# Altium schematic sheet RM04-KITV.SchDoc
size 558 x 431 mm
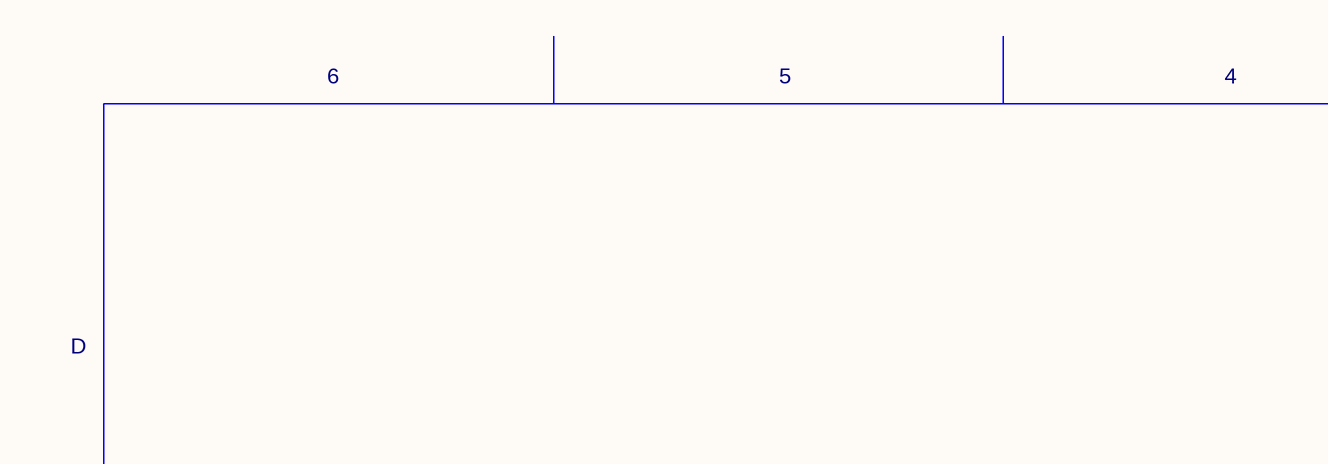
[diagram p0: RM04-KITV.SchDoc, top left]
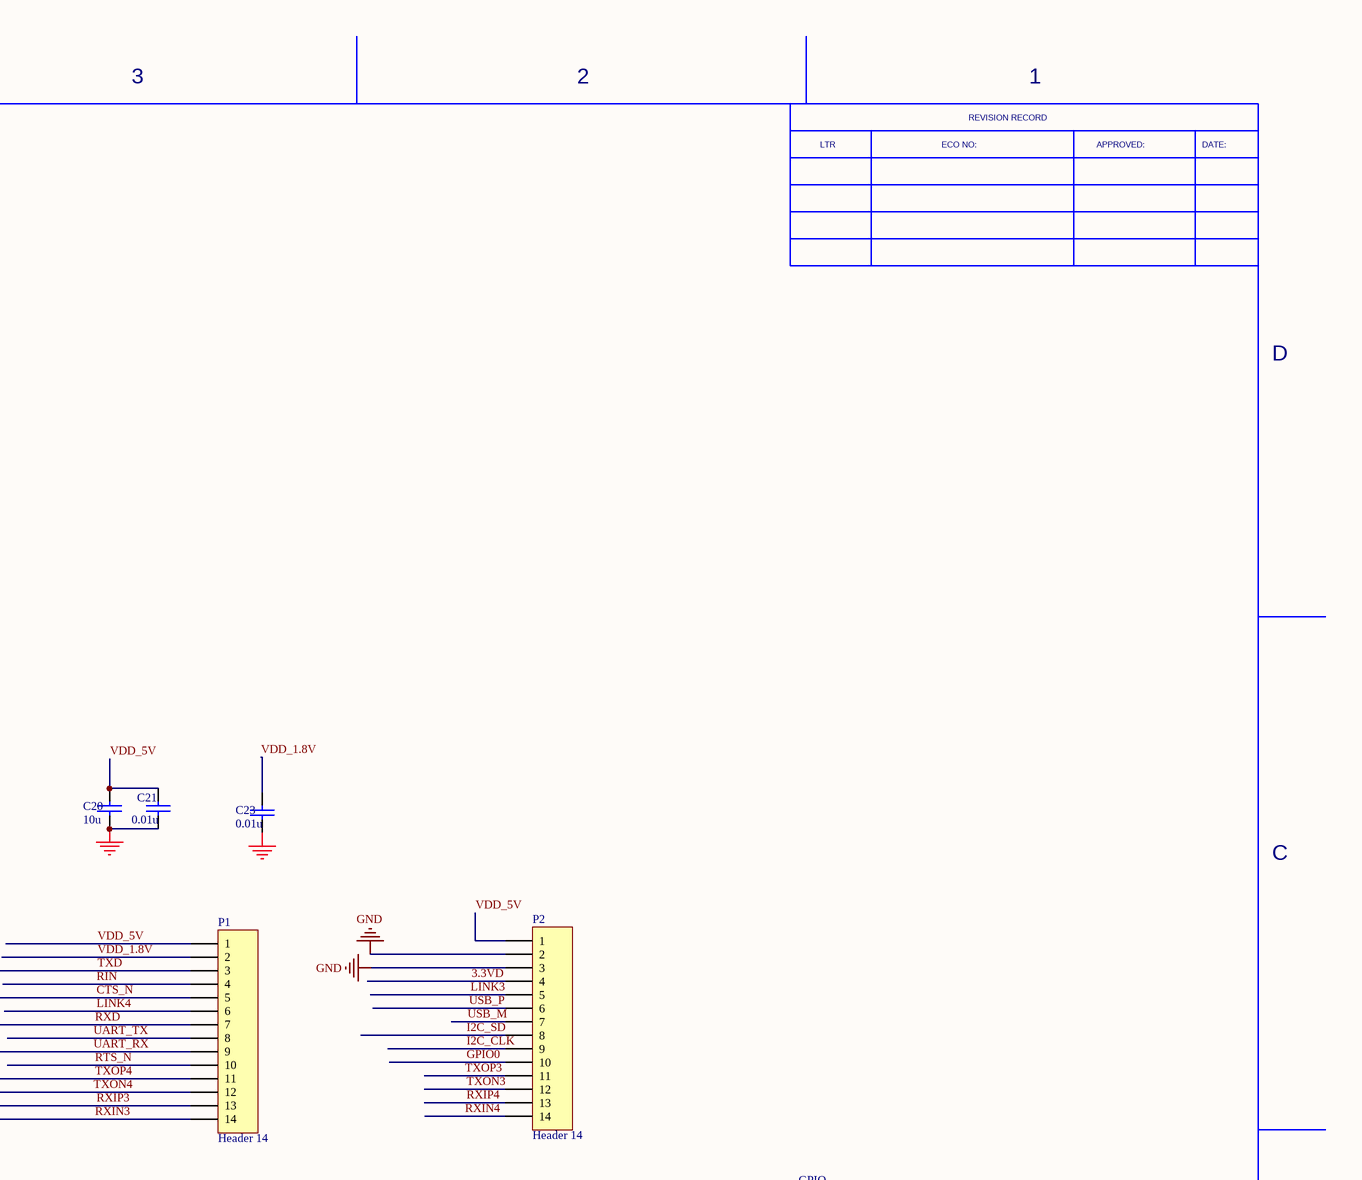
[diagram p1: RM04-KITV.SchDoc, top right]
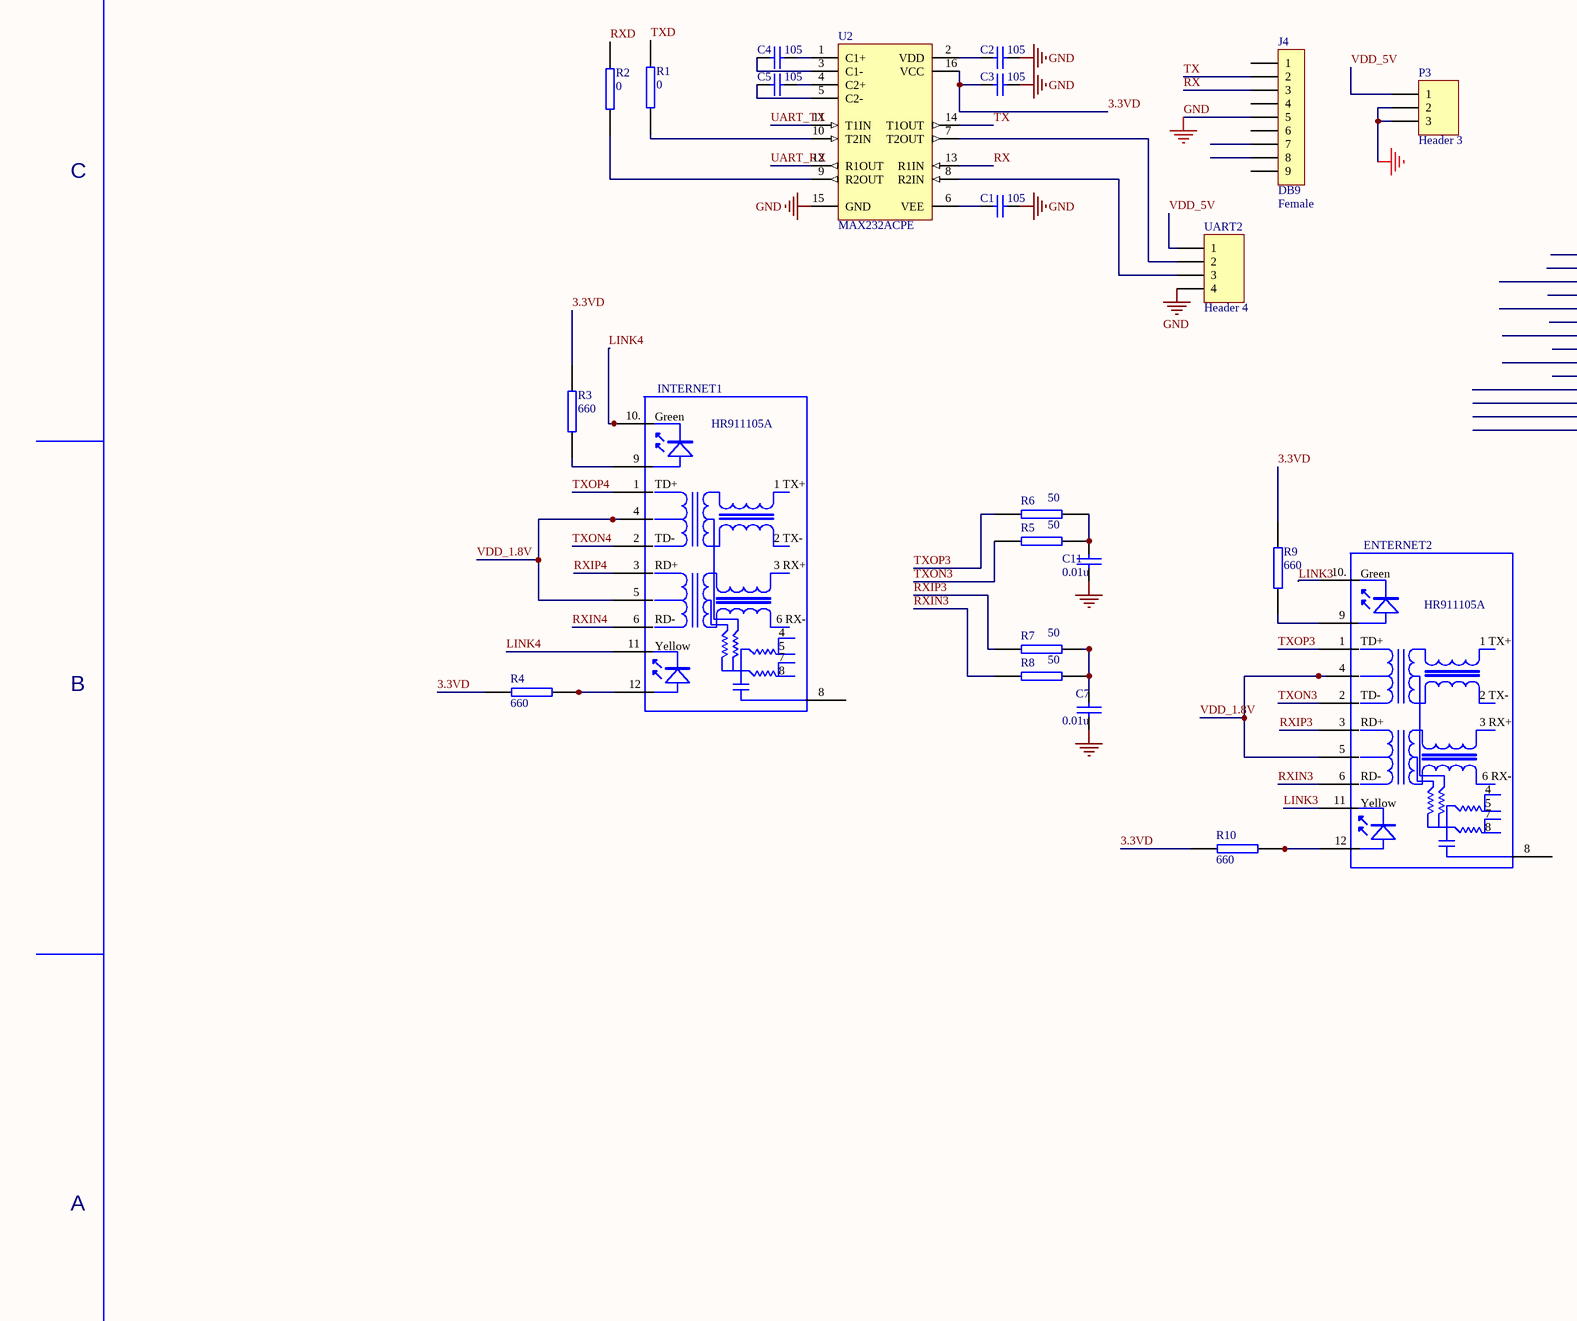
[diagram p2: RM04-KITV.SchDoc, bottom left]
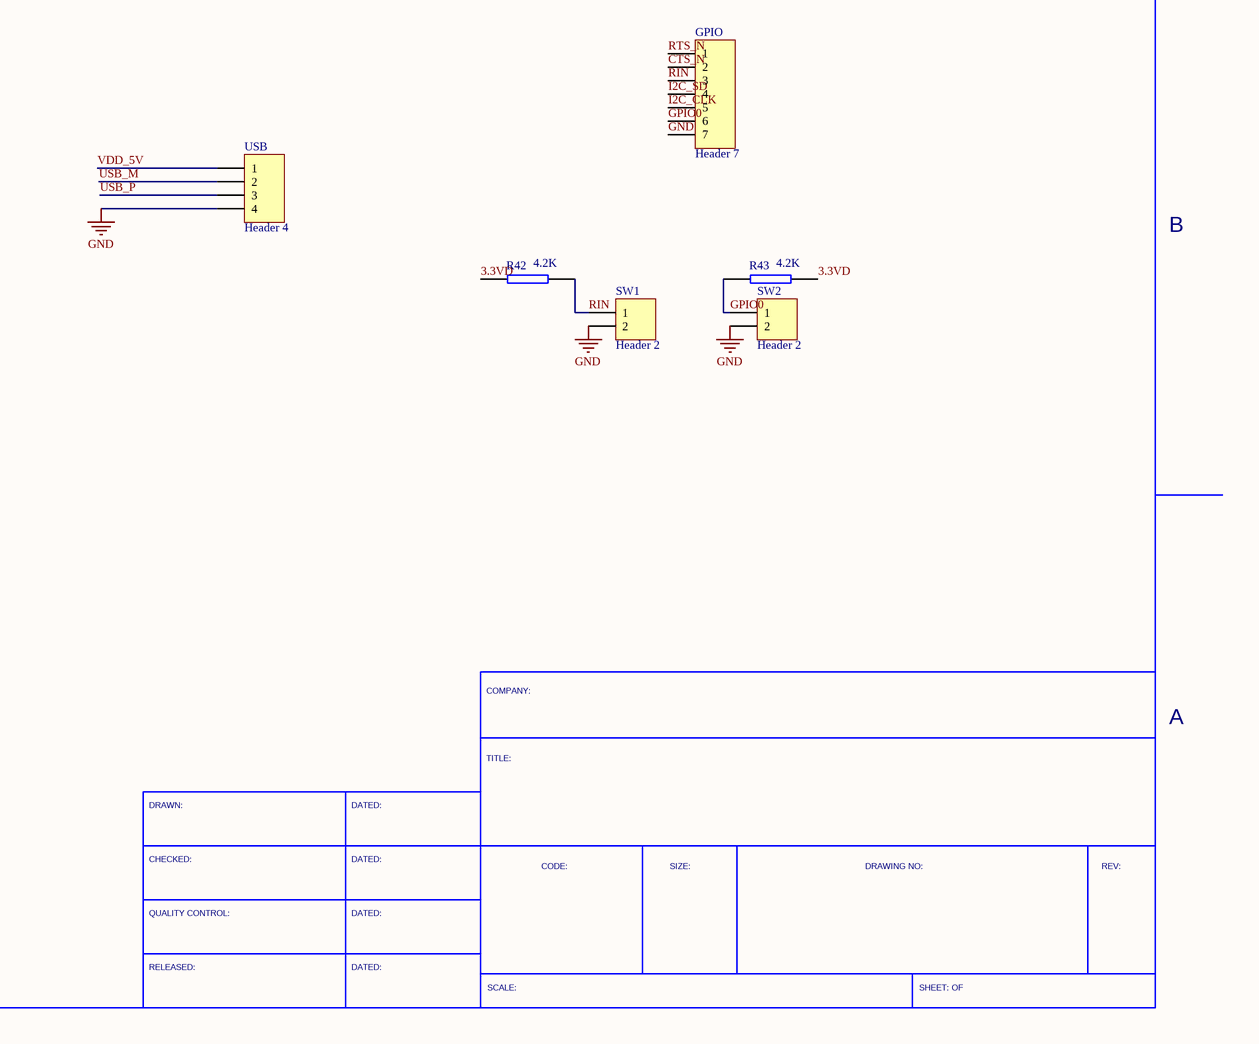
[diagram p3: RM04-KITV.SchDoc, bottom right]

## Parts
C1  105  [0603]
C2  105  [0603]
C3  105  [0603]
C4  105  [0603]
C5  105  [0603]
C7  0.01u  [0603]
C11  0.01u  [0603]
C20  10u  [0805]
C21  0.01u  [0603]
C23  0.01u  [0603]
ENTERNET2  HR911105A  [HR911105A]
GPIO  Header 7  [HDR1X7]
INTERNET1  HR911105A  [HR911105A]
J4  DB9  [DB9S]
P1  Header 14  [H1*14-2.0]
P2  Header 14  [H1*14-2.0]
P3  Header 3  [POWER_STK1]
R1  0  [0603]
R2  0  [0603]
R3  660  [0603]
R4  660  [0603]
R5  50  [0603]
R6  50  [0603]
R7  50  [0603]
R8  50  [0603]
R9  660  [0603]
R10  660  [0603]
R42  4.2K  [0603]
R43  4.2K  [0603]
SW1  Header 2  [HDR1X2]
SW2  Header 2  [HDR1X2]
U2  MAX232ACPE  [SOP-16]
UART2  Header 4  [HDR1X4]
USB  Header 4  [USB_A]

## Nets
GND: C1.1 C2.1 C3.1 C7.1 C11.1 C20.1 C21.1 C23.1 GPIO.7 J4.5 P2.2 P2.3 P3.2 P3.3 SW1.2 SW2.2 U2.15(GND) UART2.4 USB.4
3.3VD: C3.2 P2.4 R3.1 R4.2 R9.1 R10.2 R42.2 R43.1 U2.16(VCC)
CTS_N: GPIO.2 P1.5
GPIO0: GPIO.6 P2.10 R43.2 SW2.1
I2C_CLK: GPIO.5 P2.9
I2C_SD: GPIO.4 P2.8
LINK3: ENTERNET2.10. ENTERNET2.11 P2.5
LINK4: INTERNET1.10. INTERNET1.11 P1.6
RIN: GPIO.3 P1.4 R42.1 SW1.1
RTS_N: GPIO.1 P1.10
RX: J4.3 U2.13(R1IN)
RXD: P1.7 R2.2
RXIN3: ENTERNET2.6 P1.14 R8.1
RXIN4: INTERNET1.6 P2.14
RXIP3: ENTERNET2.3 P1.13 R7.1
RXIP4: INTERNET1.3 P2.13
TX: J4.2 U2.14(T1OUT)
TXD: P1.3 R1.2
TXON3: ENTERNET2.2 P2.12 R5.1
TXON4: INTERNET1.2 P1.12
TXOP3: ENTERNET2.1 P2.11 R6.2
TXOP4: INTERNET1.1 P1.11
UART_RX: P1.9 U2.12(R1OUT)
UART_TX: P1.8 U2.11(T1IN)
USB_M: P2.7 USB.2
USB_P: P2.6 USB.3
VDD_1.8V: C23.2 ENTERNET2.4 ENTERNET2.5 INTERNET1.4 INTERNET1.5 P1.2
VDD_5V: C20.2 C21.2 P1.1 P2.1 P3.1 UART2.1 USB.1
NetC1_2: C1.2 U2.6(VEE)
NetC2_2: C2.2 U2.2(VDD)
NetC4_1: C4.1 U2.1(C1+)
NetC4_2: C4.2 U2.3(C1-)
NetC5_1: C5.1 U2.4(C2+)
NetC5_2: C5.2 U2.5(C2-)
NetC7_2: C7.2 R7.2 R8.2
NetC11_2: C11.2 R5.2 R6.1
NetENTERNET2_9: ENTERNET2.9 R9.2
NetENTERNET2_12: ENTERNET2.12 R10.1
NetINTERNET1_9: INTERNET1.9 R3.2
NetINTERNET1_12: INTERNET1.12 R4.1
NetR1_1: R1.1 U2.10(T2IN)
NetR2_1: R2.1 U2.9(R2OUT)
NetU2_7: U2.7(T2OUT) UART2.2
NetU2_8: U2.8(R2IN) UART2.3

Not connected (* = marked no-connect by the designer): ENTERNET2 8; INTERNET1 8; J4 1 4 6 7 8 9

## Notes on the sheet
- 6
- 5
- 4
- 3
- 2
- 1
- LTR
- ECO NO:
- REVISION RECORD
- APPROVED:
- DATE:
- D
- C
- (near J4) Female
- B
- COMPANY:
- A
- TITLE:
- DRAWN:
- DATED:
- CHECKED:
- CODE:
- SIZE:
- DRAWING NO:
- REV:
- QUALITY CONTROL:
- RELEASED:
- SCALE:
- SHEET: OF
- (in symbol HR911105A) Green; TD+; 1 TX+; TD-; 2 TX-; RD+; 3 RX+; RD-; 6 RX-; Yellow; 7

## Library data of the parts
C1-C5 = Cap: Capacitor; Value: 100pF; Published: 8-Jun-2000; LatestRevisionDate: 17-Jul-2002; LatestRevisionNote: Re-released for DXP Platform.; PackageReference: RAD-0.3; Publisher: Altium Limited
C7 C11 C20 C21 C23 = CAP: Capacitor
GPIO = Header 7: Header, 7-Pin; LatestRevisionDate: 17-Jul-2002; LatestRevisionNote: Re-released for DXP Platform.; Publisher: Altium Limited
J4 = CON9: Connector
P1 P2 = Header 14: Header, 14-Pin; LatestRevisionDate: 17-Jul-2002; LatestRevisionNote: Re-released for DXP Platform.; Publisher: Altium Limited
P3 = Header 3: Header, 3-Pin; LatestRevisionDate: 17-Jul-2002; LatestRevisionNote: Re-released for DXP Platform.; Publisher: Altium Limited
R1-R10 R42 R43 = RES2
SW1 SW2 = Header 2: Header, 2-Pin; LatestRevisionDate: 17-Jul-2002; LatestRevisionNote: Re-released for DXP Platform.; Publisher: Altium Limited
U2 = MAX232ACPE: +5V Powered, Multi-Channel RS-232 Driver/Receiver; PackageDocument: 1997; Published: 16-Jan-2001; LatestRevisionDate: 6-Jun-2005; LatestRevisionNote: Stylized 3D Model Added.; PackageReference: PE16A; Publisher: Altium Limited; Code_JEDEC: MS-001-BB; ComponentLink1Description: Manufacturer Link; ComponentLink1URL: http://www.maxim-ic.com/; ComponentLink2Description: Datasheet; ComponentLink2URL: http://pdfserv.maxim-ic.com/en/ds/MAX220-MAX249.pdf
UART2 USB = Header 4: Header, 4-Pin; LatestRevisionDate: 17-Jul-2002; LatestRevisionNote: Re-released for DXP Platform.; Publisher: Altium Limited